# EAGLE design AnalogReader2v2 (EAGLE 5.00)
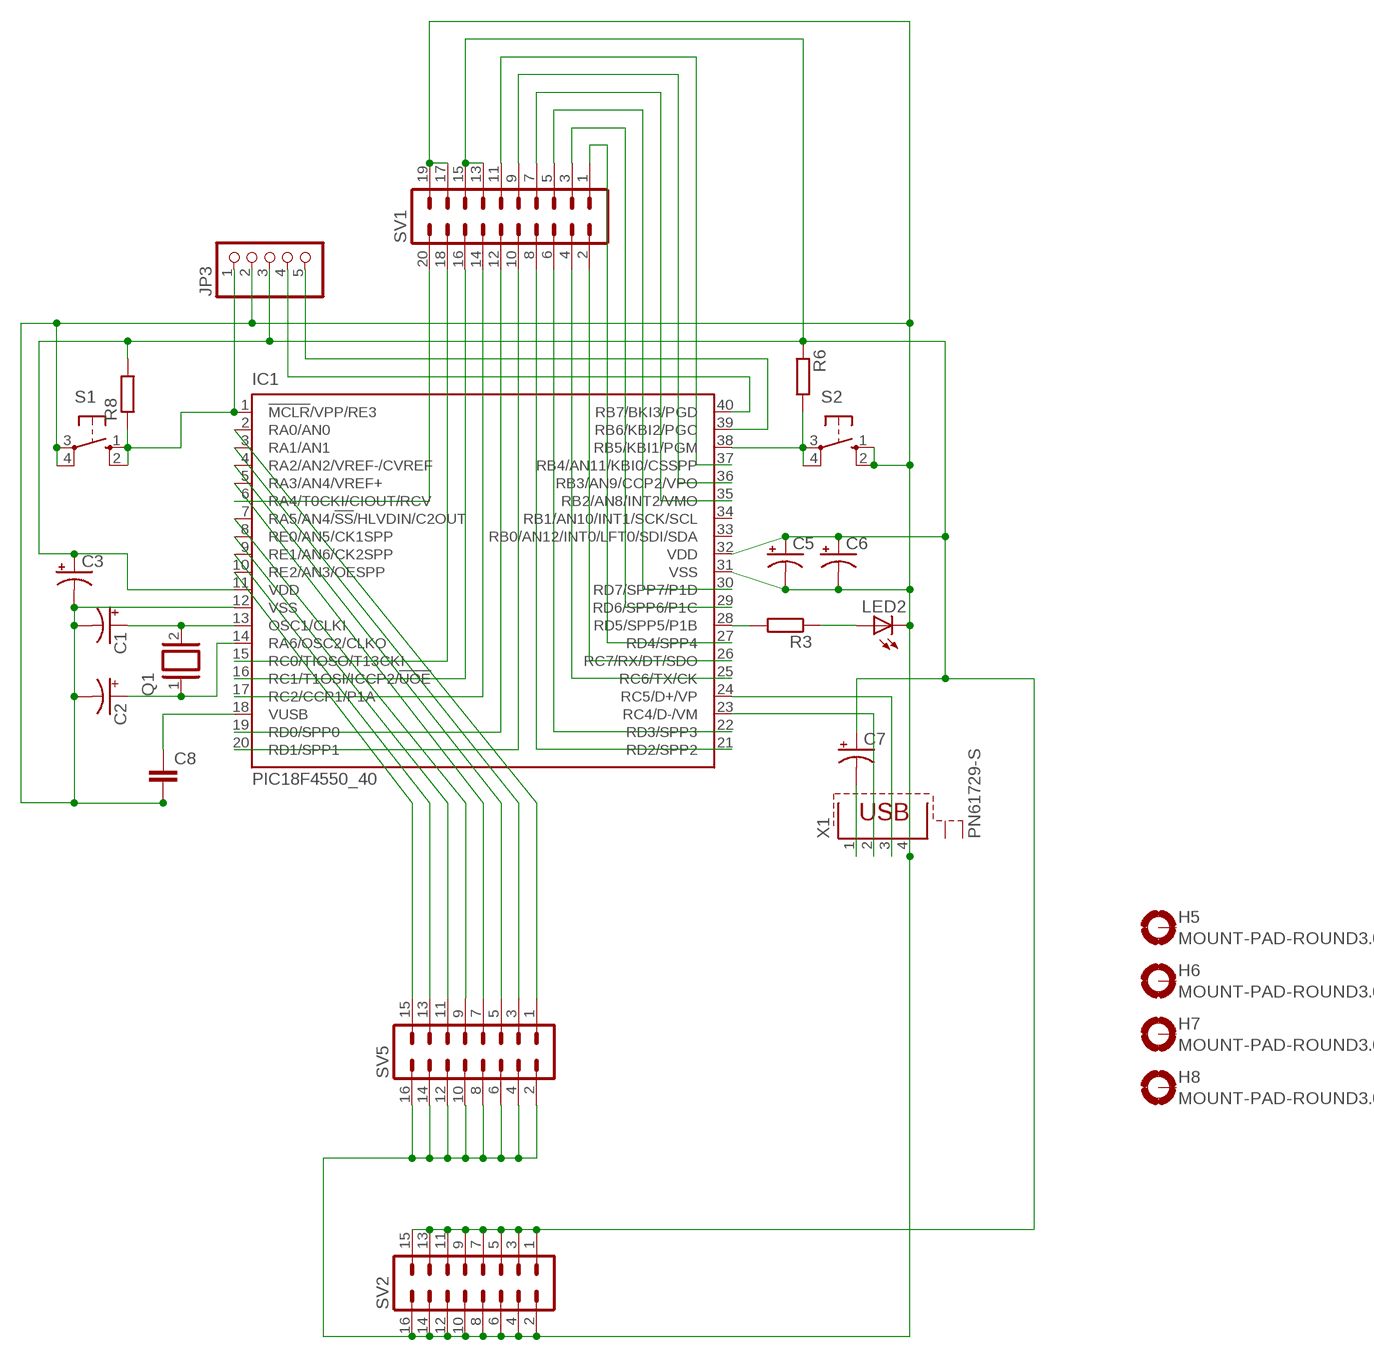
[diagram p0: schematic, sheet 1]

## Parts
C1  CPOL-USE5-6  [E5-6]
C2  CPOL-USE5-6  [E5-6]
C3  CPOL-USE5-6  [E5-6]
C5  CPOL-USE5-6  [E5-6]
C6  CPOL-USE5-6  [E5-6]
C7  CPOL-USE5-6  [E5-6]
C8  C2,5-3  [C2.5-3]
H5  MOUNT-PAD-ROUND3.0  [3,0-PAD]
H6  MOUNT-PAD-ROUND3.0  [3,0-PAD]
H7  MOUNT-PAD-ROUND3.0  [3,0-PAD]
H8  MOUNT-PAD-ROUND3.0  [3,0-PAD]
IC1  PIC18F4550_40  [DIL40]
JP3  PINHD-1X5  [1X05]
LED2  LED5MM  [LED5MM]
Q1  XTAL/S  [QS]
R3  R-EU_0204/7  [0204/7]
R6  R-EU_0204/7  [0204/7]
R8  R-EU_0204/7  [0204/7]
S1  10-XX  [B3F-10XX]
S2  10-XX  [B3F-10XX]
SV1  MA10-2  [MA10-2]
SV2  MA08-2  [MA08-2]
SV5  MA08-2  [MA08-2]
X1  PN61729-S  [PN61729-S]

## Nets
B$3: C3.+ C5.+ C6.+ C7.+ IC1.11(VDD) IC1.32(VDD) JP3.3 R6.1 R8.2 SV1.13 SV1.15 SV2.1 SV2.3 SV2.5 SV2.7 SV2.9 SV2.11 SV2.13 SV2.15
N$1: IC1.40(RB7/BKI3/PGD) JP3.4
N$2: IC1.19(RD0/SPP0) SV1.12
N$3: IC1.35(RB2/AN8/INT2/VMO) SV1.7
N$4: C7.- X1.1
N$5: C2.+ IC1.14(RA6/OSC2/CLKO) Q1.1
N$6: C8.1 IC1.18(VUSB)
N$7: IC1.37(RB4/AN11/KBI0/CSSPP) SV1.11
N$8: IC1.39(RB6/KBI2/PGC) JP3.5
N$9: IC1.36(RB3/AN9/CCP2/VPO) SV1.9
N$10: IC1.23(RC4/D-/VM) X1.2
N$11: IC1.24(RC5/D+/VP) X1.3
N$12: IC1.1(!MCLR!/VPP/RE3) JP3.1 R8.1 S1.1(S) S1.2(S1)
N$13: IC1.28(RD5/SPP5/P1B) R3.2
N$14: IC1.2(RA0/AN0) SV5.1
N$15: C1.+ IC1.13(OSC1/CLKI) Q1.2
N$16: IC1.3(RA1/AN1) SV5.3
N$17: IC1.4(RA2/AN2/VREF-/CVREF) SV5.5
N$18: IC1.5(RA3/AN4/VREF+) SV5.7
N$19: IC1.7(RA5/AN4/!SS!/HLVDIN/C2OUT) SV5.9
N$20: IC1.8(RE0/AN5/CK1SPP) SV5.11
N$21: IC1.9(RE1/AN6/CK2SPP) SV5.13
N$22: IC1.10(RE2/AN3/OESPP) SV5.15
N$23: IC1.38(RB5/KBI1/PGM) R6.2 S2.3(P) S2.4(P1)
N$24: IC1.6(RA4/T0CKI/CIOUT/RCV) SV1.20
N$25: IC1.30(RD7/SPP7/P1D) SV1.5
N$26: IC1.29(RD6/SPP6/P1C) SV1.3
N$27: IC1.27(RD4/SPP4) SV1.1
N$28: IC1.26(RC7/RX/DT/SDO) SV1.2
N$29: IC1.25(RC6/TX/CK) SV1.4
N$30: IC1.22(RD3/SPP3) SV1.6
N$31: IC1.21(RD2/SPP2) SV1.8
N$32: IC1.20(RD1/SPP1) SV1.10
N$33: IC1.17(RC2/CCP1/P1A) SV1.14
N$34: IC1.16(RC1/T1OSI/ICCP2/!UOE) SV1.16
N$35: IC1.15(RC0/TIOSO/T13CKI) SV1.18
N$36: LED2.A R3.1
N$40: C1.- C2.- C3.- C5.- C6.- C8.2 IC1.12(VSS) IC1.31(VSS) JP3.2 LED2.K(C) S1.3(P) S1.4(P1) S2.1(S) S2.2(S1) SV1.17 SV1.19 SV2.2 SV2.4 SV2.6 SV2.8 SV2.10 SV2.12 SV2.14 SV2.16 SV5.2 SV5.4 SV5.6 SV5.8 SV5.10 SV5.12 SV5.14 SV5.16 X1.4
Unconnected: H5.B3,0(MOUNT) H6.B3,0(MOUNT) H7.B3,0(MOUNT) H8.B3,0(MOUNT) IC1.33(RB0/AN12/INT0/LFT0/SDI/SDA) IC1.34(RB1/AN10/INT1/SCK/SCL) X1.S1 X1.S2

## Library data of the parts
C1-C3 C5-C7 = rcl:CPOL-US: POLARIZED CAPACITOR, American symbol
C8 = capacitor-wima:C: CAPACITOR naming: grid - package width
H5-H8 = holes:MOUNT-PAD-ROUND: MOUNTING PAD, round
IC1 = microchip:PIC18F4*_40: USB Microcontrollers with nanoWatt Technology High-Performance, Enhanced Flash, 28/40/44-Pin, Source: http://ww1.microchip.com/downloads/en/devicedoc/39632c.pdf
JP3 = pinhead:PINHD-1X5: PIN HEADER
LED2 = led:LED: LED OSRAM: - CHIPLED LG R971, LG N971, LY N971, LG Q971, LY Q971, LO R971, LY R971 LH N974, LH R974 LS Q976, LO Q976, LY Q976 LO Q996 - Hyper CHIPLED LW Q18S LB Q993, LB Q99A, LB R99A - SideLED LS A670, LO A670, LY A670, LG A670, LP A670 LB A673, LV A673, LT A673, LW A673 LH A674 LY A675 LS A676, LA A676, LO A676, LY A676, LW A676 LS A679, LY A679, LG A679 - Hyper Micro SIDELED® LS Y876, LA Y876, LO Y876, LY Y876 LT Y87S - SmartLED LW L88C, LW L88S LB L89C, LB L89S, LG L890 LS L89K, LO L89K, LY L89K LS L896, LA L896, LO L896, LY L896 - TOPLED LS T670, LO T670, LY T670, LG T670, LP T670 LSG T670, LSP T670, LSY T670, LOP T670, LYG T670 LG T671, LOG T671, LSG T671 LB T673, LV T673, LT T673, LW T673 LH T674 LS T676, LA T676, LO T676, LY T676, LB T676, LH T676, LSB T676, LW T676 LB T67C, LV T67C, LT T67C, LS T67K, LO T67K, LY T67K, LW E67C LS E67B, LA E67B, LO E67B, LY E67B, LB E67C, LV E67C, LT E67C LW T67C LS T679, LY T679, LG T679 LS T770, LO T770, LY T770, LG T770, LP T770 LB T773, LV T773, LT T773, LW T773 LH T774 LS E675, LA E675, LY E675, LS T675 LS T776, LA T776, LO T776, LY T776, LB T776 LHGB T686 LT T68C, LB T68C - Hyper Mini TOPLED® LB M676 - Mini TOPLED Santana® LG M470 LS M47K, LO M47K, LY M47K Source: http://www.osram.convergy.de - LUMILED® LXK2-PW12-R00, LXK2-PW12-S00, LXK2-PW14-U00, LXK2-PW14-V00 LXK2-PM12-R00, LXK2-PM12-S00, LXK2-PM14-U00 LXK2-PE12-Q00, LXK2-PE12-R00, LXK2-PE12-S00, LXK2-PE14-T00, LXK2-PE14-U00 LXK2-PB12-K00, LXK2-PB12-L00, LXK2-PB12-M00, LXK2-PB14-N00, LXK2-PB14-P00, LXK2-PB14-Q00 LXK2-PR12-L00, LXK2-PR12-M00, LXK2-PR14-Q00, LXK2-PR14-R00 LXK2-PD12-Q00, LXK2-PD12-R00, LXK2-PD12-S00 LXK2-PH12-R00, LXK2-PH12-S00 LXK2-PL12-P00, LXK2-PL12-Q00, LXK2-PL12-R00 Source: www.luxeon.com
Q1 = special:XTAL/S: CRYSTAL
R3 R6 R8 = rcl:R-EU_: RESISTOR, European symbol
S1 S2 = switch-omron:10-XX: OMRON SWITCH
SV1 = con-lstb:MA10-2: PIN HEADER
SV2 SV5 = con-lstb:MA08-2: PIN HEADER
X1 = con-berg:PN61729-S: BERG USB connector

## Board
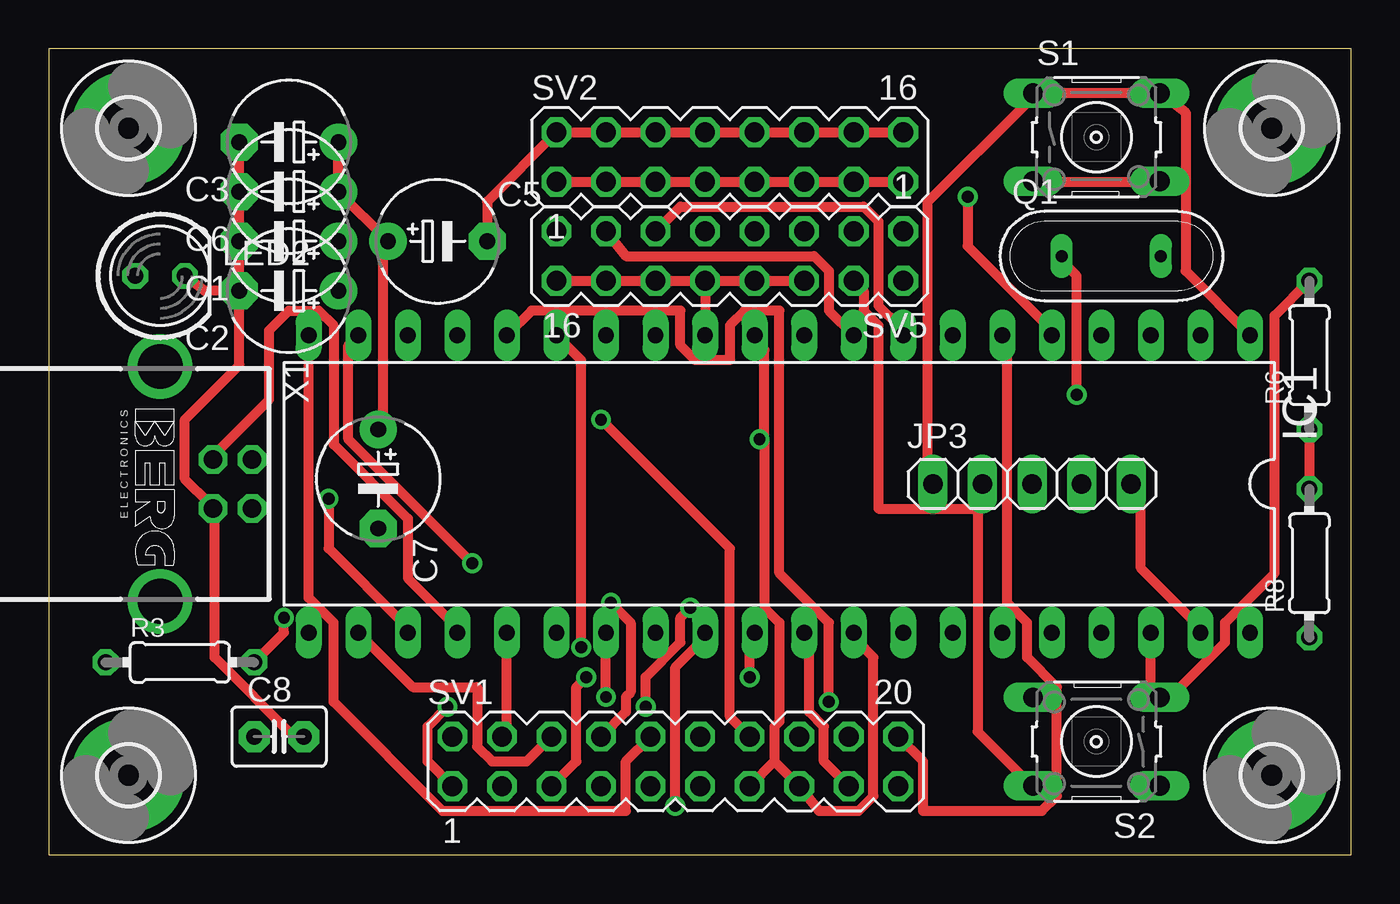
[diagram p1: board, top side]
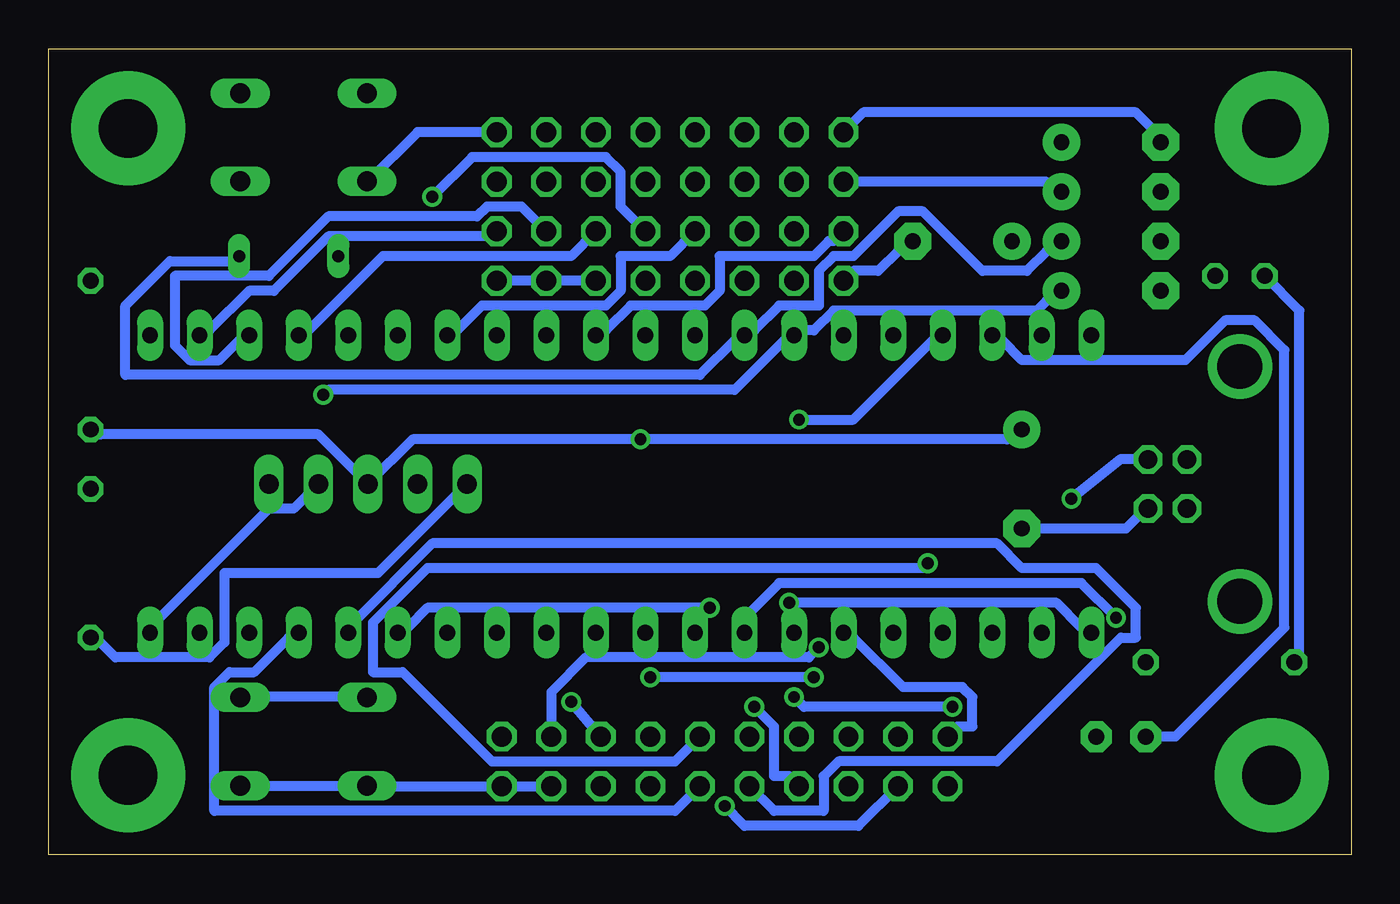
[diagram p2: board, bottom side, seen from below]

Size 66.78 x 41.33 mm. Coordinates in mm from the lower left corner, seen from the top.
Outline: 0,0 66.78,0 66.78,41.33 0,41.33 0,0
Copper layers (1*16): Top 0.035mm / dielectric 1.5mm / Bottom 0.035mm
Design rules "default *": minimum track width 20mil, minimum drill 24mil, track to track 8mil, track to pad 8mil, pad to pad 8mil, via to via 8mil, smd to smd 8mil, copper to edge 40mil, drill to drill 8mil, minimum pad ring 10mil, minimum via ring 8mil, stop-mask expansion 4mil, vias tented up to drill 0mil, thermal gap 10mil

### Footprints (pad centres in the part's own frame; a part is rotated, then mirrored left to right if it is on the bottom)
E5-6 = drill 0.813 pad 1.905 round: + -2.54,0 | drill 0.813 pad 1.905 octagon: - 2.54,0
C2.5-3 = drill 0.813 pad 1.6 octagon: 1 -1.27,0; 2 1.27,0
3,0-PAD = drill 3 pad 5.842 round: B3,0 0,0
DIL40 = drill 0.813 long: 1 -24.13,-7.62; 2 -21.59,-7.62; 3 -19.05,-7.62; 4 -16.51,-7.62; 5 -13.97,-7.62; 6 -11.43,-7.62; 7 -8.89,-7.62; 8 -6.35,-7.62; 9 -3.81,-7.62; 10 -1.27,-7.62; 11 1.27,-7.62; 12 3.81,-7.62; 13 6.35,-7.62; 14 8.89,-7.62; 15 11.43,-7.62; 16 13.97,-7.62; 17 16.51,-7.62; 18 19.05,-7.62; 19 21.59,-7.62; 20 24.13,-7.62; 21 24.13,7.62; 22 21.59,7.62; 23 19.05,7.62; 24 16.51,7.62; 25 13.97,7.62; 26 11.43,7.62; 27 8.89,7.62; 28 6.35,7.62; 29 3.81,7.62; 30 1.27,7.62; 31 -1.27,7.62; 32 -3.81,7.62; 33 -6.35,7.62; 34 -8.89,7.62; 35 -11.43,7.62; 36 -13.97,7.62; 37 -16.51,7.62; 38 -19.05,7.62; 39 -21.59,7.62; 40 -24.13,7.62
1X05 = drill 1.016 long: 1 -5.08,0; 2 -2.54,0; 3 0,0; 4 2.54,0; 5 5.08,0
LED5MM = drill 0.813 octagon: A -1.27,0; K 1.27,0
QS = drill 0.61 long: 1 -2.54,0; 2 2.54,0
0204/7 = drill 0.813 octagon: 1 -3.81,0; 2 3.81,0
B3F-10XX = drill 1.016 long: 1 -3.251,2.261; 2 3.251,2.261; 3 -3.251,-2.261; 4 3.251,-2.261
MA10-2 = drill 1.016 octagon: 1 -11.43,-1.27; 2 -11.43,1.27; 3 -8.89,-1.27; 4 -8.89,1.27; 5 -6.35,-1.27; 6 -6.35,1.27; 7 -3.81,-1.27; 8 -3.81,1.27; 9 -1.27,-1.27; 10 -1.27,1.27; 11 1.27,-1.27; 12 1.27,1.27; 13 3.81,-1.27; 14 3.81,1.27; 15 6.35,-1.27; 16 6.35,1.27; 17 8.89,-1.27; 18 8.89,1.27; 19 11.43,-1.27; 20 11.43,1.27
MA08-2 = drill 1.016 octagon: 1 -8.89,-1.27; 2 -8.89,1.27; 3 -6.35,-1.27; 4 -6.35,1.27; 5 -3.81,-1.27; 6 -3.81,1.27; 7 -1.27,-1.27; 8 -1.27,1.27; 9 1.27,-1.27; 10 1.27,1.27; 11 3.81,-1.27; 12 3.81,1.27; 13 6.35,-1.27; 14 6.35,1.27; 15 8.89,-1.27; 16 8.89,1.27
PN61729-S = drill 0.95 octagon: 1 1.25,4.71; 2 -1.25,4.71; 3 -1.25,2.71; 4 1.25,2.71 | drill 2.3 pad 2.9 round: S1 -6.02,0; S2 6.02,0

### Placement (x,y rotation side)
C1  12.31,31.46 180 top
C2  12.31,28.92 180 top
C3  12.31,36.54 180 top
C5  19.93,31.46 0 top
C6  12.31,34 180 top
C7  16.89,19.27 270 top
C8  11.81,6.06 0 top
H5  4.08,37.25 0 top
H6  4.08,4.08 0 top
H7  62.71,37.25 0 top
H8  62.71,4.08 0 top
IC1  37.46,19.01 180 top
JP3  50.41,19.01 0 top
LED2  5.71,29.68 0 top
Q1  54.48,30.7 0 top
R3  6.73,9.87 0 top
R6  64.64,25.62 90 top
R8  64.64,14.95 90 top
S1  53.72,36.79 0 top
S2  53.72,5.8 180 top
SV1  32.13,4.79 0 top
SV2  34.92,35.78 0 top
SV5  34.92,30.7 180 top
X1  5.71,19.01 270 top

### Tracks (layer width: path | path; a pad name or v marks a point on that pad's centre or on a via)
B$3  (via drill 0.61)
  Top 0.508: IC1.32 41.52,10.88 42.29,10.12 42.29,3.01 41.52,2.25 39.49,2.25 SV1.15 37.21,4.79 | 36.7,21.3 36.7,12.66 37.46,11.9 37.46,6.82 37.21,6.57 37.21,4.79 | 36.7,21.3 36.7,25.87 36.44,26.12 IC1.11 | 37.21,4.79 SV1.13 | R6.1 R8.2 | C3.+ C6.+ C5.+ 17.14,30.7 17.14,22.57 C7.+ | v36.44,21.3 36.7,21.3 | SV2.15 SV2.13 SV2.11 SV2.9 SV2.7 SV2.5 SV2.3 SV2.1
  Bottom 0.508: R6.1 64.13,21.55 52.95,21.55 JP3.3 48.13,21.3 v36.44,21.3 17.65,21.3 C7.+ | C6.+ 15.62,34.51 SV2.1
N$1
  Bottom 0.508: IC1.40 61.34,11.9 55.49,17.74 54.22,17.74 JP3.4
N$2  (via drill 0.61)
  Top 0.508: IC1.19 15.36,26.12 15.36,21.3 v21.71,14.95
  Bottom 0.508: v21.71,14.95 21.97,14.69 47.37,14.69 50.16,11.9 50.16,9.36 48.64,9.36 44.06,4.79 34.67,4.79 SV1.12
N$3  (via drill 0.61)
  Top 0.508: v32.89,12.66 32.38,12.15 32.38,10.88 30.6,9.11 v30.6,7.58
  Bottom 0.508: v32.89,12.66 47.37,12.66 48.38,11.65 IC1.35 | v30.6,7.58 29.59,6.57 29.59,4.03 28.82,4.03 SV1.7
N$4
  Bottom 0.508: X1.1 10.54,17.74 11.55,16.73 C7.-
N$5  (via drill 0.61)
  Top 0.508: v52.7,23.58 52.7,29.68 52.19,30.19 Q1.1
  Bottom 0.508: v52.7,23.58 52.45,23.84 31.62,23.84 29.08,26.38 IC1.14 28.06,26.89 27.55,26.89 26.54,27.9 16.12,27.9 15.62,28.41 C2.+
N$6
  Bottom 0.508: IC1.18 17.9,26.38 16.89,25.36 8.5,25.36 6.47,27.39 4.95,27.39 3.42,25.87 3.42,11.65 9.01,6.06 C8.1
N$7
  Bottom 0.508: IC1.37 54.48,11.14 56.26,9.36 57.53,9.36 58.29,8.6 58.29,2.25 34.67,2.25 SV1.11
N$8
  Top 0.508: IC1.39 58.8,11.9 56,14.69 56,18.5 JP3.5
N$9
  Bottom 0.508: IC1.36 51.18,11.9 47.11,15.96 18.16,15.96 16.89,14.69 13.08,14.69 11.04,12.66 11.04,11.14 11.81,11.14 18.16,4.79 26.28,4.79 27.05,4.03 27.05,2.25 29.59,2.25 SV1.9
N$10  (via drill 0.61)
  Top 0.508: v14.35,18.25 14.35,15.71 18.16,11.9 IC1.23
  Bottom 0.508: v14.35,18.25 11.81,20.28 10.28,20.28 X1.2
N$11
  Top 0.508: IC1.24 20.7,11.9 18.41,14.19 18.41,17.23 14.6,21.04 14.6,27.14 13.84,27.9 12.31,27.9 11.3,26.89 11.3,23.33 8.5,20.54 X1.3
N$12
  Top 0.508: IC1.1 58.29,29.93 58.29,38.06 57.02,39.08 S1.2 56.26,39.08 51.18,39.08 S1.1 50.16,38.57 45.08,33.49 45.08,19.52 JP3.1
  Bottom 0.508: R8.1 64.13,10.88 63.37,10.12 58.54,10.12 57.78,10.88 57.78,14.44 49.91,14.44 JP3.1
N$13  (via drill 0.61)
  Top 0.508: v12.06,12.15 12.06,11.39 R3.2
  Bottom 0.508: v12.06,12.15 13.84,13.93 29.33,13.93 31.36,11.9 IC1.28
N$14
  Bottom 0.508: IC1.2 58.54,26.89 56.51,28.92 55.24,28.92 52.45,31.71 44.32,31.71 SV5.1
N$15
  Bottom 0.508: Q1.2 57.53,30.44 60.57,30.44 62.86,28.16 62.86,24.6 33.4,24.6 31.62,26.38 IC1.13 30.6,26.89 29.33,28.16 27.3,28.16 27.3,29.93 26.54,30.7 25.52,30.7 23.24,32.98 21.97,32.98 18.92,29.93 16.63,29.93 15.62,30.95 C1.+
N$16
  Bottom 0.508: IC1.3 57.02,26.38 58.03,25.36 59.56,25.36 60.32,26.12 60.32,29.68 55.49,29.68 52.45,32.73 44.83,32.73 44.32,33.24 42.54,33.24 SV5.3
N$17
  Bottom 0.508: IC1.4 53.46,26.89 49.65,30.7 40,30.7 SV5.5
N$18  (via drill 0.61)
  Top 0.508: v47.11,33.74 47.11,31.2 51.18,27.14 IC1.5
  Bottom 0.508: v47.11,33.74 45.08,35.78 38.22,35.78 37.46,35.01 37.46,33.24 SV5.7
N$19
  Bottom 0.508: IC1.7 45.84,26.89 44.57,28.16 38.22,28.16 37.46,28.92 37.46,30.7 34.92,30.7 SV5.9
N$20
  Top 0.508: IC1.8 43.56,27.14 42.54,28.16 42.54,32.47 41.78,33.24 32.38,33.24 SV5.11
N$21
  Top 0.508: SV5.13 29.59,30.7 39.24,30.7 40,29.93 40,27.9 IC1.9
N$22
  Bottom 0.508: IC1.10 38.22,26.89 36.95,28.16 33.14,28.16 32.38,28.92 32.38,30.7 27.55,30.7 26.79,31.46 26.54,31.46 SV5.15
N$23
  Top 0.508: IC1.38 56.51,8.6 S2.3 57.53,8.09 60.32,10.88 60.32,11.9 62.86,14.44 62.86,27.65 R6.2
  Bottom 0.508: S2.4 51.18,8.09 56.26,8.09 S2.3
N$24
  Top 0.508: IC1.6 49.14,26.12 49.14,12.92 50.16,11.9 50.16,10.12 51.68,8.6 51.68,3.01 50.92,2.25 44.83,2.25 44.83,4.79 SV1.20
N$25  (via drill 0.61)
  Top 0.508: v35.94,9.11 35.94,10.88 IC1.30 | v27.55,9.11 27.05,8.6 27.05,4.79 SV1.5
  Bottom 0.508: v27.55,9.11 v35.94,9.11
N$26  (via drill 0.61)
  Top 0.508: v32.13,2.5 32.13,9.61 33.4,10.88 IC1.29
  Bottom 0.508: v32.13,2.5 31.11,1.49 25.27,1.49 SV1.3
N$27  (via drill 0.61)
  Top 0.508: v20.44,7.58 19.43,6.57 19.43,4.79 SV1.1 | v28.57,8.09 IC1.27
  Bottom 0.508: v28.57,8.09 28.06,7.58 v20.44,7.58
N$28
  Bottom 0.508: IC1.26 25.52,11.14 22.98,8.6 19.93,8.6 19.43,8.09 19.43,6.57 20.19,6.57 SV1.2
N$29
  Top 0.508: IC1.25 23.49,6.57 SV1.4
N$30
  Top 0.508: SV1.6 24.51,4.79 22.73,4.79 21.97,5.55 21.97,8.6 18.66,8.6 IC1.22
N$31  (via drill 0.61)
  Top 0.508: v28.82,12.92 29.84,11.9 29.84,8.34 29.59,8.09 29.59,7.33 SV1.8
  Bottom 0.508: v28.82,12.92 15.11,12.92 13.84,11.65 IC1.21
N$32
  Top 0.508: IC1.20 13.33,13.17 14.6,11.9 14.6,7.84 20.19,2.25 29.59,2.25 29.59,4.79 SV1.10
N$33  (via drill 0.61)
  Top 0.508: v28.32,22.31 34.92,15.71 34.92,7.07 SV1.14
  Bottom 0.508: v28.32,22.31 25.52,22.31 21.46,26.38 IC1.17
N$34  (via drill 0.61)
  Top 0.508: v40,7.84 40,11.9 37.46,14.44 37.46,27.9 35.68,27.9 34.92,27.14 34.92,25.36 33.14,25.36 32.38,26.12 32.38,27.9 24.76,27.9 IC1.16
  Bottom 0.508: SV1.16 v40,7.84
N$35  (via drill 0.61)
  Top 0.508: v27.3,10.63 27.3,25.36 IC1.15
  Bottom 0.508: v27.3,10.63 27.81,10.12 39.24,10.12 41.02,8.34 SV1.18
N$36
  Bottom 0.508: R3.1 2.66,10.12 2.66,27.9 LED2.A
N$40
  Top 0.508: C3.- C6.- C1.- C2.- | LED2.K 8,28.92 C2.- | C2.- 9.77,25.11 6.98,22.31 6.98,19.27 8.25,18 X1.4 8.5,17.49 8.5,10.12 12.57,6.06 C8.2 | IC1.31 38.98,10.88 38.98,7.33 39.75,6.57 39.75,4.79 SV1.17 | 47.62,17.74 47.62,6.31 50.16,3.77 S2.2 | 47.62,17.74 47.62,18.5 JP3.2 | SV5.16 SV5.14 SV5.12 SV5.10 | SV5.6 SV5.8 SV5.10 | SV5.10 IC1.12 | S1.3 51.18,34.51 56.26,34.51 S1.4 | SV2.16 SV2.14 SV2.12 SV2.10 SV2.8 SV2.6 SV2.4 SV2.2 22.47,33.49 C5.- | 47.62,17.74 42.54,17.74 42.54,27.14 41.78,27.9 41.78,28.92 SV5.4
  Bottom 0.508: SV1.17 SV1.19 49.91,3.52 S2.2 51.18,3.52 56.26,3.52 S2.1 | C5.- 23.24,30.95 24.25,29.93 25.52,29.93 SV5.16 | SV5.2 SV5.4 SV5.6 | S1.3 50.41,34.51 47.87,37.05 SV2.16 | C3.- 10.03,37.05 11.04,38.06 25.01,38.06 SV2.2

### Text on the board
text: www.endurance-rc.com | AN8 | AN7 | AN6 | AN5 | AN4 | AN3 | AN2 | AN1 | RESET | (c) Endurance R/C | AnalogReader v1.2 | GND | +5V | POWER | INPUT | GND | 1 | PROGRAM | Button Connector